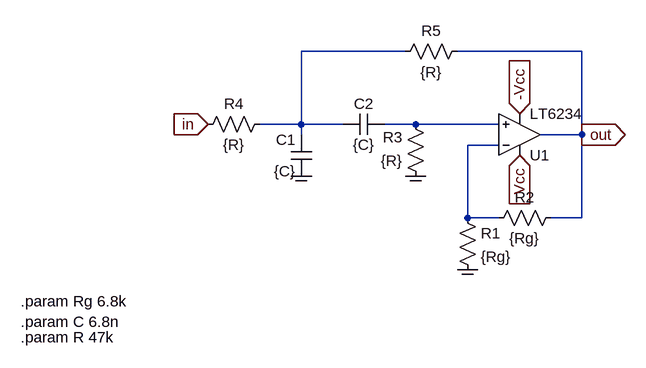
[diagram p0: schematic Etaj2-symb.asc]
Etaj2-symb.asc, the LTspice schematic file:
Version 4
SHEET 1 880 680
WIRE 112 96 -48 96
WIRE 384 96 192 96
WIRE -48 208 -48 96
WIRE -48 208 -112 208
WIRE 16 208 -48 208
WIRE 128 208 80 208
WIRE 256 208 128 208
WIRE -48 224 -48 208
WIRE 384 224 384 96
WIRE 384 224 320 224
WIRE 256 240 208 240
WIRE 208 352 208 240
WIRE 256 352 208 352
WIRE 384 352 384 224
WIRE 384 352 336 352
FLAG -48 288 COM
IOPIN -48 288 In
FLAG 128 288 COM
IOPIN 128 288 In
FLAG 208 432 COM
IOPIN 208 432 In
FLAG 288 256 Vcc
IOPIN 288 256 In
FLAG 288 192 -Vcc
IOPIN 288 192 In
FLAG -192 208 in
IOPIN -192 208 In
FLAG 384 224 out
IOPIN 384 224 Out
SYMBOL res 144 304 R180
WINDOW 0 36 76 Left 2
WINDOW 3 36 40 Left 2
SYMATTR InstName R3
SYMATTR Value {R}
SYMBOL res -208 224 R270
WINDOW 0 32 56 VTop 2
WINDOW 3 0 56 VBottom 2
SYMATTR InstName R4
SYMATTR Value {R}
SYMBOL cap -32 288 R180
WINDOW 0 24 56 Left 2
WINDOW 3 24 8 Left 2
SYMATTR InstName C1
SYMATTR Value {C}
SYMBOL cap 16 224 R270
WINDOW 0 32 32 VTop 2
WINDOW 3 0 32 VBottom 2
SYMATTR InstName C2
SYMATTR Value {C}
SYMBOL OpAmps\\LT6234 288 224 M180
SYMATTR InstName U1
SYMBOL res 192 336 R0
SYMATTR InstName R1
SYMATTR Value {Rg}
SYMBOL res 352 336 R90
WINDOW 0 0 56 VBottom 2
WINDOW 3 32 56 VTop 2
SYMATTR InstName R2
SYMATTR Value {Rg}
SYMBOL res 208 80 R90
WINDOW 0 0 56 VBottom 2
WINDOW 3 32 56 VTop 2
SYMATTR InstName R5
SYMATTR Value {R}
TEXT -480 480 Left 2 !.param Rg 6.8k
TEXT -480 536 Left 2 !.param R 47k
TEXT -480 512 Left 2 !.param C 6.8n

The netlist it stands for:
* Etaj2-symb.asc
R3 COM N002 {R}
R4 in N001 {R}
C1 COM N001 {C}
C2 N001 N002 {C}
* U1: LT6234 (symbol OpAmps\LT6234 not available, pins judged from their places): In+=N002 In-=N003 V+=Vcc V-=-Vcc OUT=out
R1 N003 COM {Rg}
R2 out N003 {Rg}
R5 out N001 {R}
.param Rg 6.8k
.param R 47k
.param C 6.8n
.backanno
.end